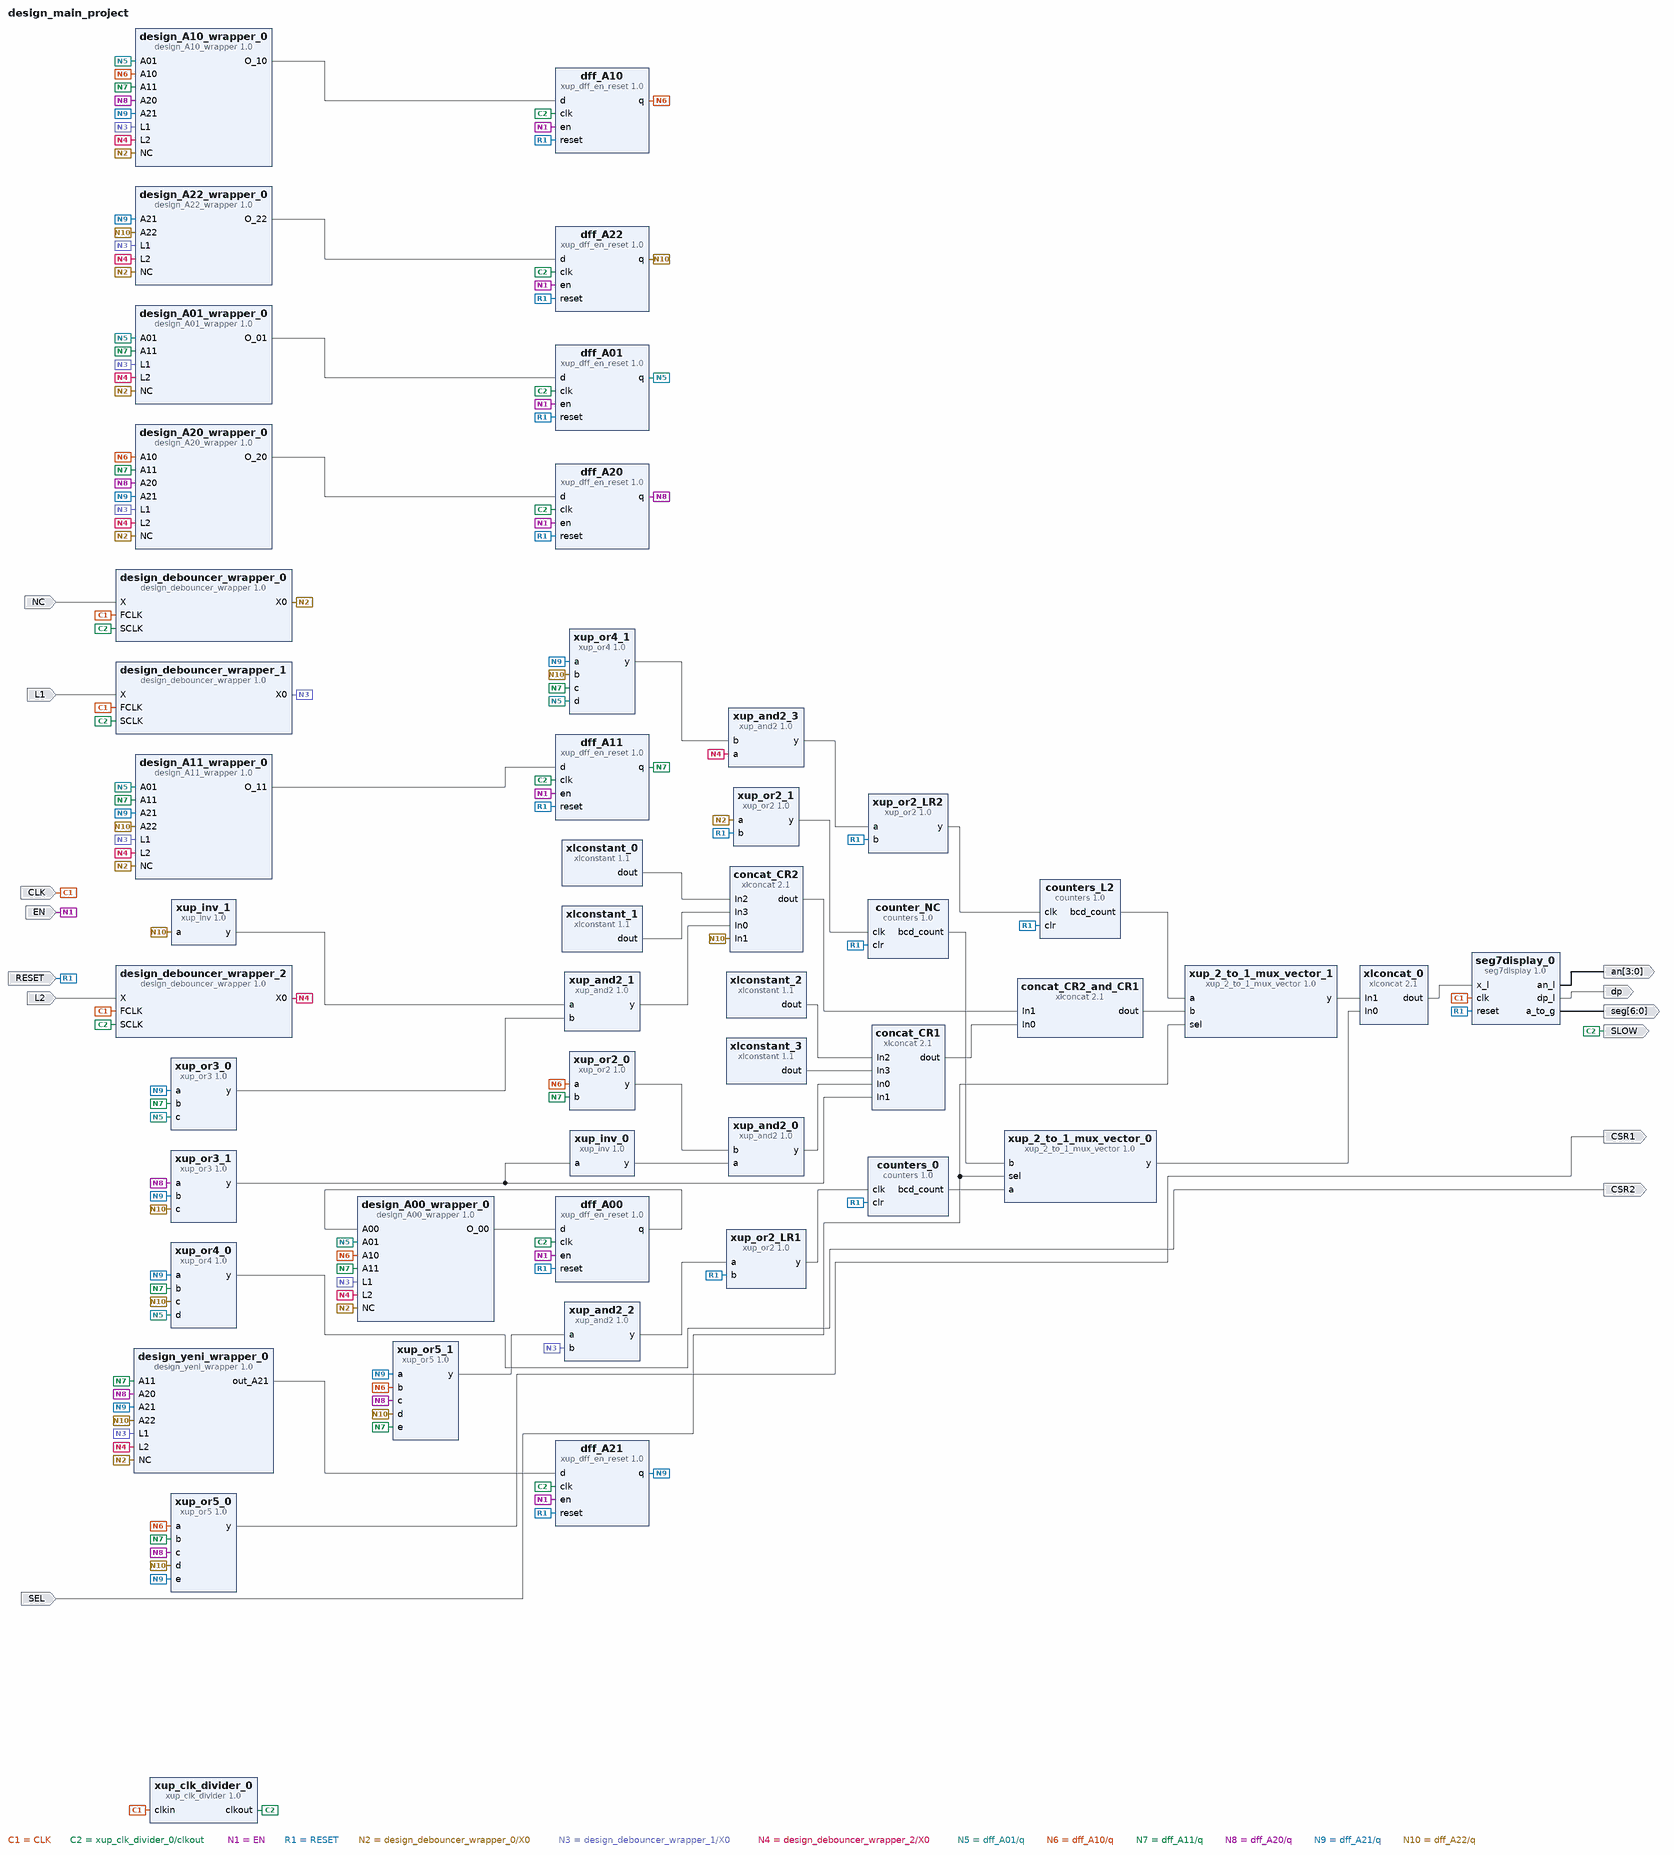
[diagram p0: block diagram of the top level]
# Vivado block design design_main_project, xc7a35tcpg236-1, Vivado 2016.4
create_bd_design design_main_project

create_bd_port -dir I NC
create_bd_port -dir I L1
create_bd_port -dir I L2
create_bd_port -dir I CLK
create_bd_port -dir O SLOW
create_bd_port -dir I EN
create_bd_port -dir I RESET
create_bd_port -dir I SEL
create_bd_port -dir O -from 6 -to 0 seg
create_bd_port -dir O -from 3 -to 0 an
create_bd_port -dir O dp
create_bd_port -dir O CSR1
create_bd_port -dir O CSR2

create_bd_cell -type ip -vlnv xilinx.com:user:design_debouncer_wrapper:1.0 design_debouncer_wrapper_0
create_bd_cell -type ip -vlnv xilinx.com:user:design_debouncer_wrapper:1.0 design_debouncer_wrapper_1
create_bd_cell -type ip -vlnv xilinx.com:user:design_debouncer_wrapper:1.0 design_debouncer_wrapper_2
create_bd_cell -type ip -vlnv xilinx.com:XUP:xup_clk_divider:1.0 xup_clk_divider_0
set_property -dict {CONFIG.SIZE 200000000} [get_bd_cells xup_clk_divider_0]
create_bd_cell -type ip -vlnv xilinx.com:XUP:xup_dff_en_reset:1.0 dff_A00
create_bd_cell -type ip -vlnv xilinx.com:XUP:xup_dff_en_reset:1.0 dff_A10
create_bd_cell -type ip -vlnv xilinx.com:XUP:xup_dff_en_reset:1.0 dff_A20
create_bd_cell -type ip -vlnv xilinx.com:XUP:xup_dff_en_reset:1.0 dff_A21
create_bd_cell -type ip -vlnv xilinx.com:XUP:xup_dff_en_reset:1.0 dff_A22
create_bd_cell -type ip -vlnv xilinx.com:XUP:xup_dff_en_reset:1.0 dff_A11
create_bd_cell -type ip -vlnv xilinx.com:XUP:xup_dff_en_reset:1.0 dff_A01
create_bd_cell -type ip -vlnv xilinx.com:user:design_A00_wrapper:1.0 design_A00_wrapper_0
create_bd_cell -type ip -vlnv xilinx.com:user:design_A10_wrapper:1.0 design_A10_wrapper_0
create_bd_cell -type ip -vlnv xilinx.com:user:design_A20_wrapper:1.0 design_A20_wrapper_0
create_bd_cell -type ip -vlnv xilinx.com:user:design_A22_wrapper:1.0 design_A22_wrapper_0
create_bd_cell -type ip -vlnv xilinx.com:user:design_A11_wrapper:1.0 design_A11_wrapper_0
create_bd_cell -type ip -vlnv xilinx.com:user:design_A01_wrapper:1.0 design_A01_wrapper_0
create_bd_cell -type ip -vlnv xilinx.com:XUP:xup_2_to_1_mux_vector:1.0 xup_2_to_1_mux_vector_0
set_property -dict {CONFIG.SIZE 8 CONFIG.DELAY 0} [get_bd_cells xup_2_to_1_mux_vector_0]
create_bd_cell -type ip -vlnv xilinx.com:XUP:xup_2_to_1_mux_vector:1.0 xup_2_to_1_mux_vector_1
set_property -dict {CONFIG.SIZE 8 CONFIG.DELAY 0} [get_bd_cells xup_2_to_1_mux_vector_1]
create_bd_cell -type ip -vlnv xilinx.com:ip:xlconcat:2.1 concat_CR2
set_property -dict {CONFIG.NUM_PORTS 4} [get_bd_cells concat_CR2]
create_bd_cell -type ip -vlnv xilinx.com:ip:xlconstant:1.1 xlconstant_0
set_property -dict {CONFIG.CONST_VAL 0} [get_bd_cells xlconstant_0]
create_bd_cell -type ip -vlnv xilinx.com:ip:xlconstant:1.1 xlconstant_1
set_property -dict {CONFIG.CONST_VAL 0} [get_bd_cells xlconstant_1]
create_bd_cell -type ip -vlnv xilinx.com:XUP:xup_or3:1.0 xup_or3_0
create_bd_cell -type ip -vlnv xilinx.com:ip:xlconcat:2.1 concat_CR2_and_CR1
set_property -dict {CONFIG.IN0_WIDTH 4 CONFIG.IN1_WIDTH 4} [get_bd_cells concat_CR2_and_CR1]
create_bd_cell -type ip -vlnv xilinx.com:ip:xlconcat:2.1 concat_CR1
set_property -dict {CONFIG.NUM_PORTS 4} [get_bd_cells concat_CR1]
create_bd_cell -type ip -vlnv xilinx.com:ip:xlconstant:1.1 xlconstant_2
set_property -dict {CONFIG.CONST_VAL 0} [get_bd_cells xlconstant_2]
create_bd_cell -type ip -vlnv xilinx.com:ip:xlconstant:1.1 xlconstant_3
set_property -dict {CONFIG.CONST_VAL 0} [get_bd_cells xlconstant_3]
create_bd_cell -type ip -vlnv xilinx.com:XUP:xup_or3:1.0 xup_or3_1
create_bd_cell -type ip -vlnv xilinx.com:XUP:xup_or2:1.0 xup_or2_0
create_bd_cell -type ip -vlnv xilinx.com:XUP:xup_or2:1.0 xup_or2_1
create_bd_cell -type ip -vlnv xilinx.com:XUP:counters:1.0 counter_NC
set_property -dict {CONFIG.TYPE 2} [get_bd_cells counter_NC]
create_bd_cell -type ip -vlnv xilinx.com:XUP:counters:1.0 counters_L2
set_property -dict {CONFIG.TYPE 2} [get_bd_cells counters_L2]
create_bd_cell -type ip -vlnv xilinx.com:XUP:xup_or2:1.0 xup_or2_LR2
create_bd_cell -type ip -vlnv xilinx.com:XUP:counters:1.0 counters_0
set_property -dict {CONFIG.TYPE 2} [get_bd_cells counters_0]
create_bd_cell -type ip -vlnv xilinx.com:XUP:xup_or2:1.0 xup_or2_LR1
create_bd_cell -type ip -vlnv xilinx.com:ip:xlconcat:2.1 xlconcat_0
set_property -dict {CONFIG.IN0_WIDTH 8 CONFIG.IN1_WIDTH 8} [get_bd_cells xlconcat_0]
create_bd_cell -type ip -vlnv xilinx.com:XUP:seg7display:1.0 seg7display_0
create_bd_cell -type ip -vlnv xilinx.com:XUP:xup_and2:1.0 xup_and2_0
create_bd_cell -type ip -vlnv xilinx.com:XUP:xup_inv:1.0 xup_inv_0
create_bd_cell -type ip -vlnv xilinx.com:XUP:xup_inv:1.0 xup_inv_1
create_bd_cell -type ip -vlnv xilinx.com:XUP:xup_and2:1.0 xup_and2_1
create_bd_cell -type ip -vlnv xilinx.com:user:design_yeni_wrapper:1.0 design_yeni_wrapper_0
create_bd_cell -type ip -vlnv xilinx.com:XUP:xup_or5:1.0 xup_or5_0
create_bd_cell -type ip -vlnv xilinx.com:XUP:xup_or4:1.0 xup_or4_0
create_bd_cell -type ip -vlnv xilinx.com:XUP:xup_or5:1.0 xup_or5_1
create_bd_cell -type ip -vlnv xilinx.com:XUP:xup_and2:1.0 xup_and2_2
create_bd_cell -type ip -vlnv xilinx.com:XUP:xup_or4:1.0 xup_or4_1
create_bd_cell -type ip -vlnv xilinx.com:XUP:xup_and2:1.0 xup_and2_3

# ---- connections ----

connect_bd_net [get_bd_ports NC] [get_bd_pins design_debouncer_wrapper_0/X]
connect_bd_net -net L1_1 [get_bd_ports L1] [get_bd_pins design_debouncer_wrapper_1/X]
connect_bd_net -net L2_1 [get_bd_ports L2] [get_bd_pins design_debouncer_wrapper_2/X]
connect_bd_net [get_bd_ports CLK] \
  [get_bd_pins design_debouncer_wrapper_0/FCLK] [get_bd_pins design_debouncer_wrapper_1/FCLK] \
  [get_bd_pins design_debouncer_wrapper_2/FCLK] [get_bd_pins xup_clk_divider_0/clkin] [get_bd_pins seg7display_0/clk]
connect_bd_net [get_bd_pins xup_clk_divider_0/clkout] \
  [get_bd_ports SLOW] [get_bd_pins design_debouncer_wrapper_2/SCLK] [get_bd_pins design_debouncer_wrapper_1/SCLK] \
  [get_bd_pins design_debouncer_wrapper_0/SCLK] [get_bd_pins dff_A21/clk] [get_bd_pins dff_A00/clk] [get_bd_pins dff_A10/clk] \
  [get_bd_pins dff_A22/clk] [get_bd_pins dff_A20/clk] [get_bd_pins dff_A11/clk] [get_bd_pins dff_A01/clk]
connect_bd_net [get_bd_ports EN] \
  [get_bd_pins dff_A00/en] [get_bd_pins dff_A21/en] [get_bd_pins dff_A10/en] [get_bd_pins dff_A22/en] \
  [get_bd_pins dff_A11/en] [get_bd_pins dff_A20/en] [get_bd_pins dff_A01/en]
connect_bd_net [get_bd_ports RESET] \
  [get_bd_pins dff_A00/reset] [get_bd_pins dff_A10/reset] [get_bd_pins dff_A20/reset] [get_bd_pins dff_A21/reset] \
  [get_bd_pins dff_A22/reset] [get_bd_pins dff_A11/reset] [get_bd_pins dff_A01/reset] [get_bd_pins xup_or2_1/b] \
  [get_bd_pins counter_NC/clr] [get_bd_pins counters_L2/clr] [get_bd_pins xup_or2_LR2/b] [get_bd_pins xup_or2_LR1/b] \
  [get_bd_pins seg7display_0/reset] [get_bd_pins counters_0/clr]
connect_bd_net [get_bd_pins design_A00_wrapper_0/O_00] [get_bd_pins dff_A00/d]
connect_bd_net [get_bd_pins dff_A00/q] [get_bd_pins design_A00_wrapper_0/A00]
connect_bd_net [get_bd_pins design_debouncer_wrapper_0/X0] \
  [get_bd_pins design_A00_wrapper_0/NC] [get_bd_pins design_A10_wrapper_0/NC] [get_bd_pins design_A20_wrapper_0/NC] \
  [get_bd_pins design_A22_wrapper_0/NC] [get_bd_pins design_A11_wrapper_0/NC] [get_bd_pins design_A01_wrapper_0/NC] \
  [get_bd_pins xup_or2_1/a] [get_bd_pins design_yeni_wrapper_0/NC]
connect_bd_net [get_bd_pins design_debouncer_wrapper_1/X0] \
  [get_bd_pins design_A00_wrapper_0/L1] [get_bd_pins design_A10_wrapper_0/L1] [get_bd_pins design_A20_wrapper_0/L1] \
  [get_bd_pins design_A22_wrapper_0/L1] [get_bd_pins design_A11_wrapper_0/L1] [get_bd_pins design_A01_wrapper_0/L1] \
  [get_bd_pins design_yeni_wrapper_0/L1] [get_bd_pins xup_and2_2/b]
connect_bd_net [get_bd_pins design_debouncer_wrapper_2/X0] \
  [get_bd_pins design_A00_wrapper_0/L2] [get_bd_pins design_A10_wrapper_0/L2] [get_bd_pins design_A20_wrapper_0/L2] \
  [get_bd_pins design_A22_wrapper_0/L2] [get_bd_pins design_A11_wrapper_0/L2] [get_bd_pins design_A01_wrapper_0/L2] \
  [get_bd_pins design_yeni_wrapper_0/L2] [get_bd_pins xup_and2_3/a]
connect_bd_net [get_bd_pins dff_A01/q] \
  [get_bd_pins design_A00_wrapper_0/A01] [get_bd_pins design_A10_wrapper_0/A01] [get_bd_pins design_A11_wrapper_0/A01] \
  [get_bd_pins design_A01_wrapper_0/A01] [get_bd_pins xup_or3_0/c] [get_bd_pins xup_or4_0/d] [get_bd_pins xup_or4_1/d]
connect_bd_net [get_bd_pins dff_A10/q] \
  [get_bd_pins design_A00_wrapper_0/A10] [get_bd_pins design_A10_wrapper_0/A10] [get_bd_pins design_A20_wrapper_0/A10] \
  [get_bd_pins xup_or2_0/a] [get_bd_pins xup_or5_0/a] [get_bd_pins xup_or5_1/b]
connect_bd_net [get_bd_pins dff_A11/q] \
  [get_bd_pins design_A00_wrapper_0/A11] [get_bd_pins design_A10_wrapper_0/A11] [get_bd_pins design_A20_wrapper_0/A11] \
  [get_bd_pins design_A11_wrapper_0/A11] [get_bd_pins design_A01_wrapper_0/A11] [get_bd_pins xup_or3_0/b] \
  [get_bd_pins xup_or2_0/b] [get_bd_pins design_yeni_wrapper_0/A11] [get_bd_pins xup_or5_0/b] [get_bd_pins xup_or4_0/b] \
  [get_bd_pins xup_or5_1/e] [get_bd_pins xup_or4_1/c]
connect_bd_net [get_bd_pins design_A10_wrapper_0/O_10] [get_bd_pins dff_A10/d]
connect_bd_net [get_bd_pins dff_A20/q] \
  [get_bd_pins design_A10_wrapper_0/A20] [get_bd_pins design_A20_wrapper_0/A20] [get_bd_pins xup_or3_1/a] \
  [get_bd_pins design_yeni_wrapper_0/A20] [get_bd_pins xup_or5_0/c] [get_bd_pins xup_or5_1/c]
connect_bd_net [get_bd_pins dff_A21/q] \
  [get_bd_pins design_A10_wrapper_0/A21] [get_bd_pins design_A20_wrapper_0/A21] [get_bd_pins design_A22_wrapper_0/A21] \
  [get_bd_pins design_A11_wrapper_0/A21] [get_bd_pins xup_or3_0/a] [get_bd_pins xup_or3_1/b] \
  [get_bd_pins design_yeni_wrapper_0/A21] [get_bd_pins xup_or5_0/e] [get_bd_pins xup_or4_0/a] [get_bd_pins xup_or5_1/a] \
  [get_bd_pins xup_or4_1/a]
connect_bd_net [get_bd_pins design_A20_wrapper_0/O_20] [get_bd_pins dff_A20/d]
connect_bd_net [get_bd_pins dff_A22/q] \
  [get_bd_pins design_A22_wrapper_0/A22] [get_bd_pins design_A11_wrapper_0/A22] [get_bd_pins concat_CR2/In1] \
  [get_bd_pins xup_or3_1/c] [get_bd_pins xup_inv_1/a] [get_bd_pins design_yeni_wrapper_0/A22] [get_bd_pins xup_or5_0/d] \
  [get_bd_pins xup_or4_0/c] [get_bd_pins xup_or5_1/d] [get_bd_pins xup_or4_1/b]
connect_bd_net [get_bd_pins design_A22_wrapper_0/O_22] [get_bd_pins dff_A22/d]
connect_bd_net [get_bd_pins design_A11_wrapper_0/O_11] [get_bd_pins dff_A11/d]
connect_bd_net [get_bd_pins design_A01_wrapper_0/O_01] [get_bd_pins dff_A01/d]
connect_bd_net [get_bd_ports SEL] [get_bd_pins xup_2_to_1_mux_vector_0/sel] [get_bd_pins xup_2_to_1_mux_vector_1/sel]
connect_bd_net [get_bd_pins xlconstant_0/dout] [get_bd_pins concat_CR2/In2]
connect_bd_net [get_bd_pins xlconstant_1/dout] [get_bd_pins concat_CR2/In3]
connect_bd_net [get_bd_pins concat_CR2_and_CR1/dout] [get_bd_pins xup_2_to_1_mux_vector_1/b]
connect_bd_net [get_bd_pins xlconstant_2/dout] [get_bd_pins concat_CR1/In2]
connect_bd_net [get_bd_pins xlconstant_3/dout] [get_bd_pins concat_CR1/In3]
connect_bd_net [get_bd_pins xup_or3_1/y] [get_bd_pins concat_CR1/In1] [get_bd_pins xup_inv_0/a]
connect_bd_net [get_bd_pins xup_or2_1/y] [get_bd_pins counter_NC/clk]
connect_bd_net -net counters_0_bcd_count [get_bd_pins counter_NC/bcd_count] [get_bd_pins xup_2_to_1_mux_vector_0/b]
connect_bd_net -net counters_0_bcd_count1 [get_bd_pins counters_L2/bcd_count] [get_bd_pins xup_2_to_1_mux_vector_1/a]
connect_bd_net [get_bd_pins counters_0/bcd_count] [get_bd_pins xup_2_to_1_mux_vector_0/a]
connect_bd_net [get_bd_pins xup_2_to_1_mux_vector_0/y] [get_bd_pins xlconcat_0/In0]
connect_bd_net [get_bd_pins xup_2_to_1_mux_vector_1/y] [get_bd_pins xlconcat_0/In1]
connect_bd_net [get_bd_pins xlconcat_0/dout] [get_bd_pins seg7display_0/x_l]
connect_bd_net [get_bd_pins seg7display_0/a_to_g] [get_bd_ports seg]
connect_bd_net [get_bd_pins seg7display_0/an_l] [get_bd_ports an]
connect_bd_net [get_bd_pins seg7display_0/dp_l] [get_bd_ports dp]
connect_bd_net [get_bd_pins xup_and2_0/y] [get_bd_pins concat_CR1/In0]
connect_bd_net [get_bd_pins xup_or2_0/y] [get_bd_pins xup_and2_0/b]
connect_bd_net [get_bd_pins xup_inv_0/y] [get_bd_pins xup_and2_0/a]
connect_bd_net [get_bd_pins xup_inv_1/y] [get_bd_pins xup_and2_1/a]
connect_bd_net [get_bd_pins xup_or3_0/y] [get_bd_pins xup_and2_1/b]
connect_bd_net [get_bd_pins xup_and2_1/y] [get_bd_pins concat_CR2/In0]
connect_bd_net [get_bd_pins concat_CR2/dout] [get_bd_pins concat_CR2_and_CR1/In1]
connect_bd_net [get_bd_pins concat_CR1/dout] [get_bd_pins concat_CR2_and_CR1/In0]
connect_bd_net [get_bd_pins design_yeni_wrapper_0/out_A21] [get_bd_pins dff_A21/d]
connect_bd_net [get_bd_pins xup_or5_0/y] [get_bd_ports CSR1]
connect_bd_net [get_bd_pins xup_or4_0/y] [get_bd_ports CSR2]
connect_bd_net [get_bd_pins xup_or5_1/y] [get_bd_pins xup_and2_2/a]
connect_bd_net [get_bd_pins xup_or4_1/y] [get_bd_pins xup_and2_3/b]
connect_bd_net [get_bd_pins xup_or2_LR2/y] [get_bd_pins counters_L2/clk]
connect_bd_net [get_bd_pins xup_and2_3/y] [get_bd_pins xup_or2_LR2/a]
connect_bd_net [get_bd_pins xup_or2_LR1/y] [get_bd_pins counters_0/clk]
connect_bd_net [get_bd_pins xup_and2_2/y] [get_bd_pins xup_or2_LR1/a]

validate_bd_design
save_bd_design
